# EAGLE design PIRI-MS-S2M (EAGLE 6.4)
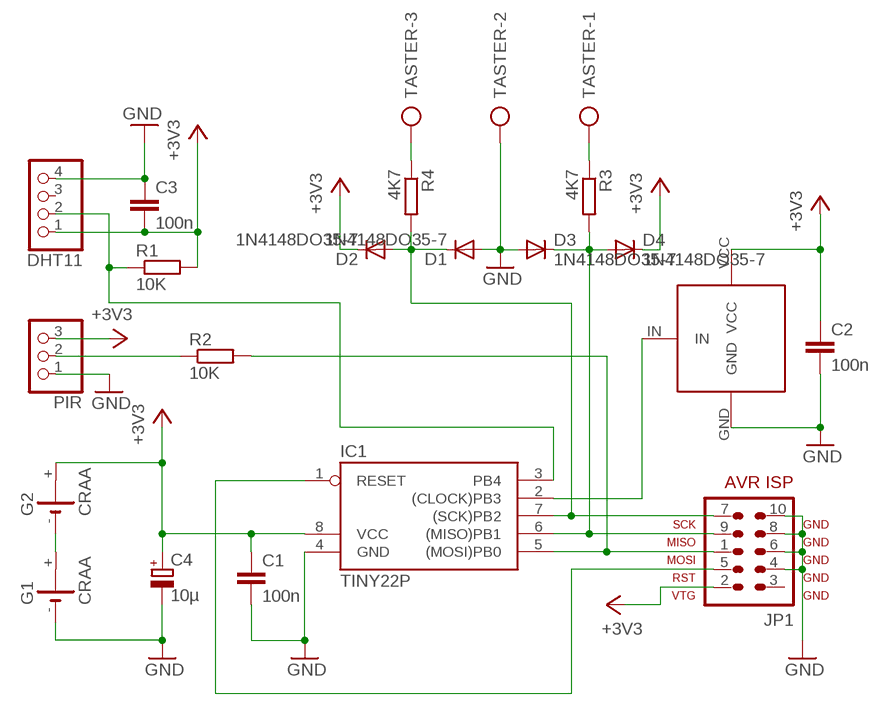
[diagram p0: schematic, sheet 1]

## Parts
C1  100n  C-EU050-024X044  [C050-024X044]
C2  100n  C-EU050-024X044  [C050-024X044]
C3  100n  C-EU050-024X044  [C050-024X044]
C4  10µ  CPOL-EUE5-4  [E5-4]
D1  1N4148DO35-7  [DO35-7]
D2  1N4148DO35-7  [DO35-7]
D3  1N4148DO35-7  [DO35-7]
D4  1N4148DO35-7  [DO35-7]
DHT11  PINHD-1X4  [1X04]
G1  CRAA  [CRAA]
G2  CRAA  [CRAA]
IC1  TINY22P  [DIL08]
JP1  AVR-ISP-10  [AVR-ISP-10]
PIR  PINHD-1X3  [1X03]
R1  10K  R-EU_0204/7  [0204/7]
R2  10K  R-EU_0204/7  [0204/7]
R3  4K7  R-EU_0204/7  [0204/7]
R4  4K7  R-EU_0204/7  [0204/7]
TASTER  AK500/3  [AK500/3]
U$1  TX868  [TX868]

## Nets
+3V3: C1.1 C2.1 C3.2 C4.+ D2.C D4.C DHT11.1 G2.+ IC1.8(VCC) JP1.2 PIR.3 R1.2 U$1.VCC
GND: C1.2 C2.2 C3.1 C4.- D1.A D3.A DHT11.4 G1.- IC1.4(GND) JP1.4 JP1.6 JP1.8 JP1.10 PIR.1 TASTER.2 U$1.GND
N$1: IC1.1(RESET) JP1.5
N$2: IC1.5((MOSI)PB0) JP1.1 R2.2
N$3: D3.C D4.A IC1.6((MISO)PB1) JP1.9 R3.2
N$4: D1.C D2.A IC1.7((SCK)PB2) JP1.7 R4.2
N$5: PIR.2 R2.1
N$6: R4.1 TASTER.3
N$7: IC1.2((CLOCK)PB3) U$1.IN
N$8: DHT11.2 IC1.3(PB4) R1.1
N$9: R3.1 TASTER.1
N$10: G1.+ G2.-
Unconnected: DHT11.3 G1.+@1(+) G2.+@1(+) JP1.3

## Library data of the parts
C1-C3 = resistor:C-EU: CAPACITOR, European symbol
C4 = resistor:CPOL-EU: POLARIZED CAPACITOR, European symbol
D1-D4 = diode:1N4148: DIODE high speed (Philips)
DHT11 = pinhead:PINHD-1X4: PIN HEADER
G1 G2 = battery:CRAA: LI BATTERY Varta
IC1 = avr-7:TINY22: MICROCONTROLLER 1K ROM 128 bytes RAM 128 bytes EEPROM
JP1 = avr-7:AVR-ISP-10: AVR ISP-10 Serial Programming Header
PIR = pinhead:PINHD-1X3: PIN HEADER
R1-R4 = resistor:R-EU_: RESISTOR, European symbol
TASTER = con-ptr500:AK500/3: CONNECTOR; OC_FARNELL: unknown; OC_NEWARK: unknown
U$1 = cassy:TX868: Sendemodul TX868 ELV

## Board
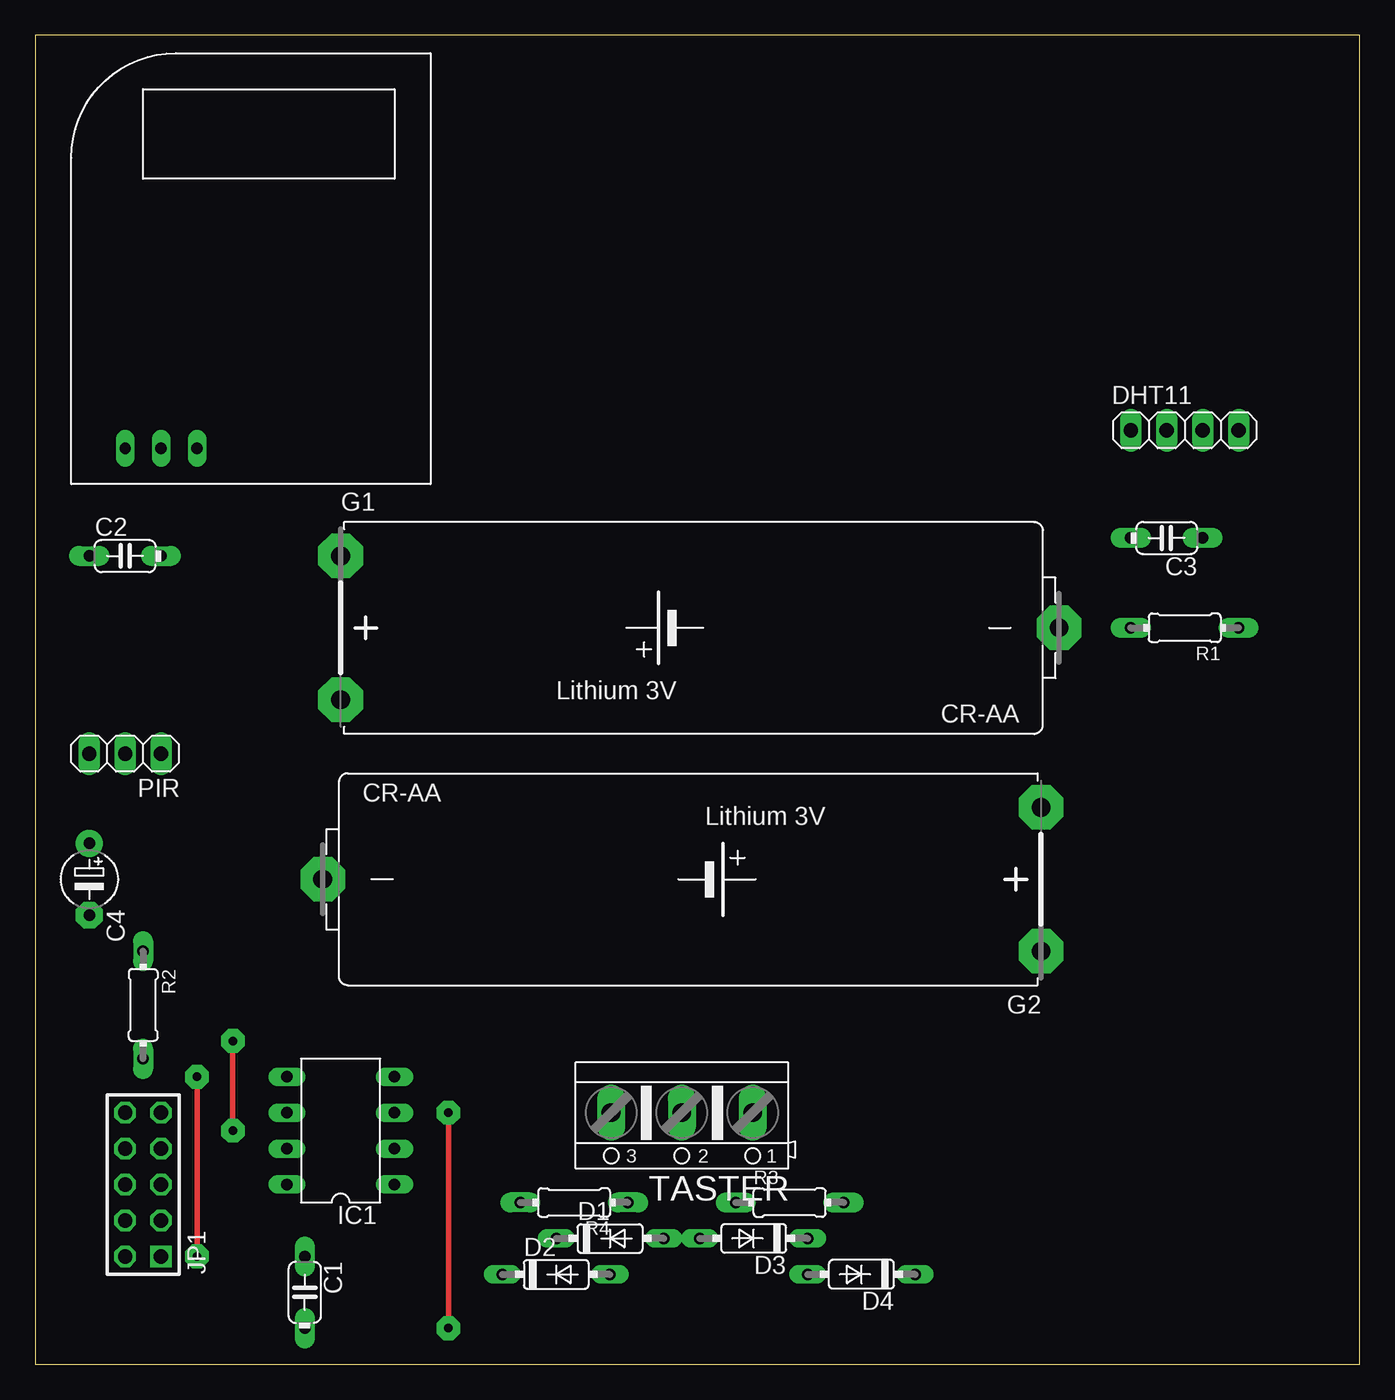
[diagram p1: board, top side]
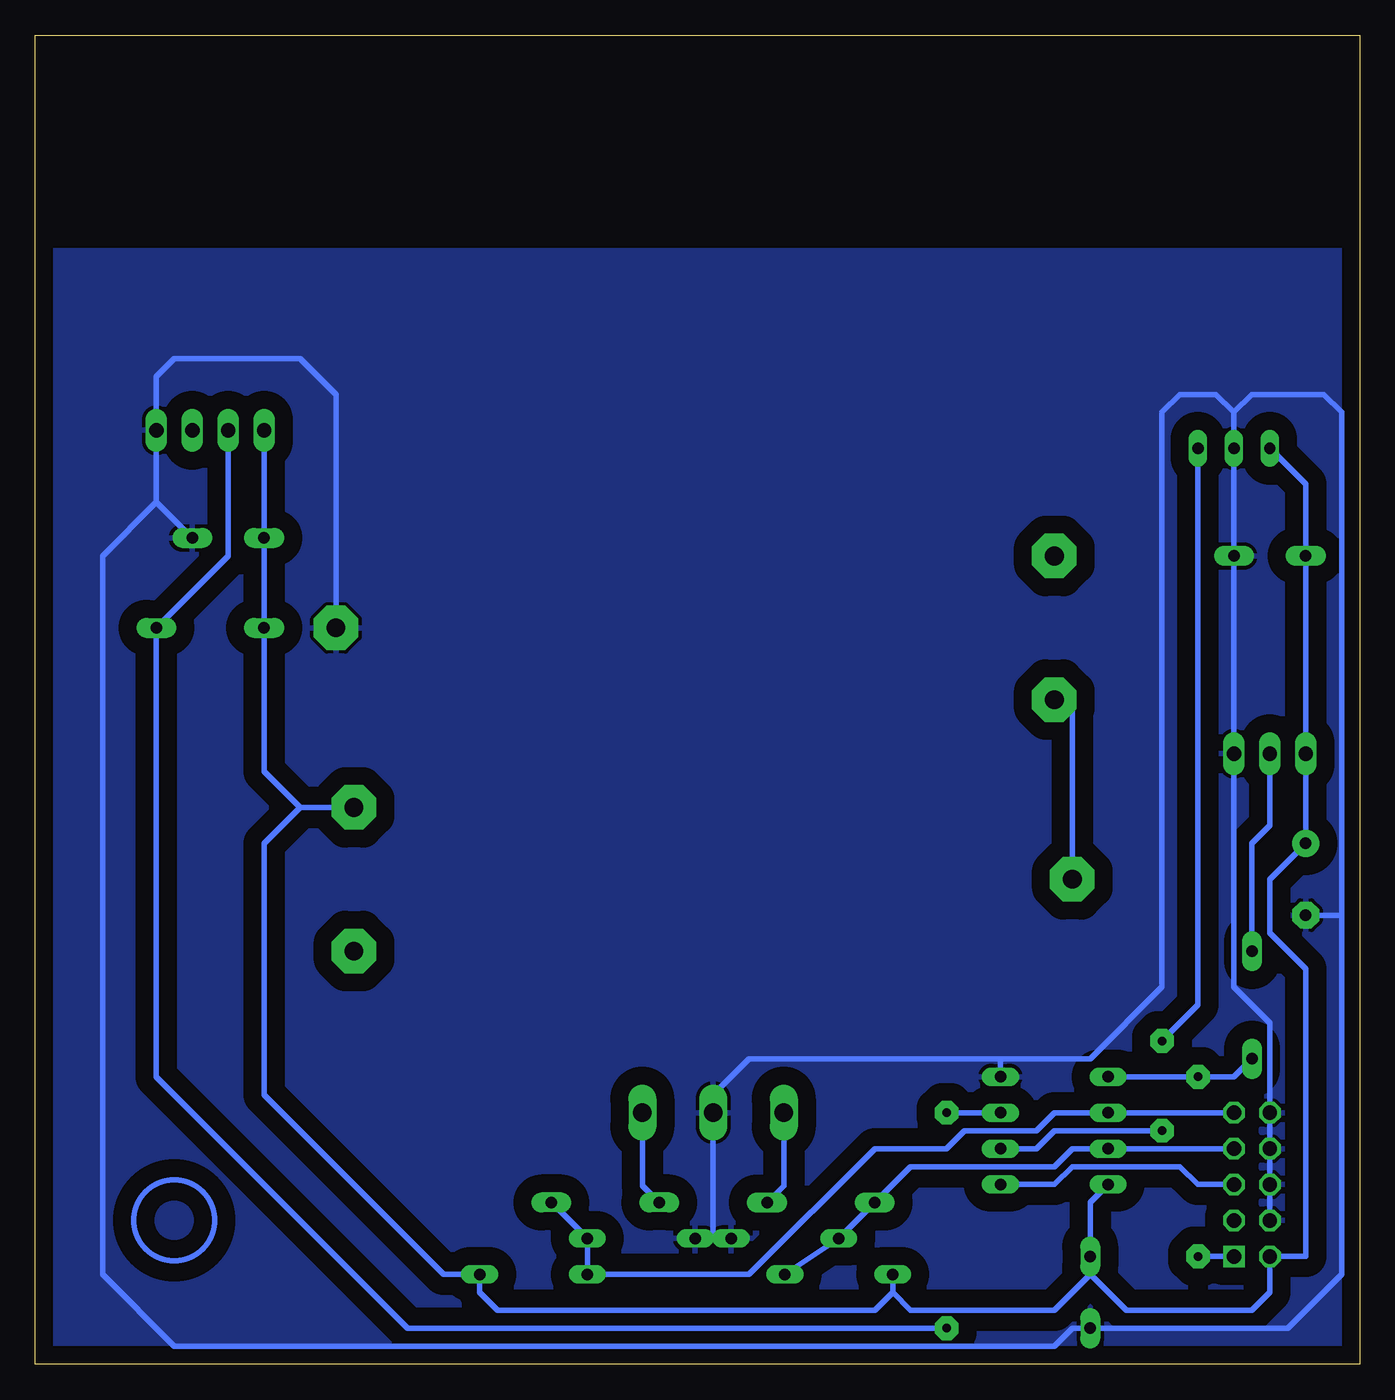
[diagram p2: board, bottom side, seen from below]

Size 93.65 x 93.97 mm. Coordinates in mm from the lower left corner, seen from the top.
Outline: 0,0 93.65,0 93.65,93.97 0,93.97 0,0
Copper layers (1*16): Top 0.035mm / dielectric 1.5mm / Bottom 0.035mm
Design rules "default": minimum track width 10mil, minimum drill 24mil, track to track 8mil, track to pad 8mil, pad to pad 8mil, via to via 8mil, smd to smd 8mil, copper to edge 40mil, drill to drill 8mil, minimum pad ring 10mil, minimum via ring 8mil, stop-mask expansion 4mil, vias tented up to drill 0mil, thermal gap 10mil

### Footprints (pad centres in the part's own frame; a part is rotated, then mirrored left to right if it is on the bottom)
C050-024X044 = drill 0.813 pad 1.422 long: 1 -2.54,0; 2 2.54,0
E5-4 = drill 0.813 pad 1.905: + -2.54,0 | drill 0.813 pad 1.905 octagon: - 2.54,0
DO35-7 = drill 0.813 long: A 3.81,0; C -3.81,0
1X04 = drill 1.016 long: 1 -3.81,0; 2 -1.27,0; 3 1.27,0; 4 3.81,0
CRAA = drill 1.321 pad 3.15 octagon: + -25.4,-5.08; +@1 -25.4,5.08; - 25.4,0
DIL08 = drill 0.813 long: 1 -3.81,-3.81; 2 -1.27,-3.81; 3 1.27,-3.81; 4 3.81,-3.81; 5 3.81,3.81; 6 1.27,3.81; 7 -1.27,3.81; 8 -3.81,3.81
AVR-ISP-10 = drill 1.016 square: 1 -5.08,-1.27 | drill 1.016 octagon: 2 -5.08,1.27; 3 -2.54,-1.27; 4 -2.54,1.27; 5 0,-1.27; 6 0,1.27; 7 2.54,-1.27; 8 2.54,1.27; 9 5.08,-1.27; 10 5.08,1.27
1X03 = drill 1.016 long: 1 -2.54,0; 2 0,0; 3 2.54,0
0204/7 = drill 0.813 pad 1.422 long: 1 -3.81,0; 2 3.81,0
AK500/3 = drill 1.321 long: 1 -5.004,0; 2 0,0; 3 5.004,0
TX868 = drill 0.8 long: GND -6.35,-12.7; IN -3.81,-12.7; VCC -8.89,-12.7

### Placement (x,y rotation side)
C1  19.05,5.08 270 top
C2  6.35,57.15 0 top
C3  80.01,58.42 180 top
C4  3.81,34.29 270 top
D1  40.64,8.89 0 top
D2  36.83,6.35 0 top
D3  50.8,8.89 180 top
D4  58.42,6.35 180 top
DHT11  81.28,66.04 0 top
G1  46.99,52.07 0 top
G2  45.72,34.29 180 top
IC1  21.59,16.51 90 top
JP1  7.62,12.7 90 top
PIR  6.35,43.18 180 top
R1  81.28,52.07 180 top
R2  7.62,25.4 270 top
R3  53.34,11.43 0 top
R4  38.1,11.43 180 top
TASTER  45.72,17.78 180 top
U$1  15.24,77.47 0 top

### Tracks (layer width: path | path; a pad name or v marks a point on that pad's centre or on a via)
+3V3
  Bottom 0.406: U$1.VCC 3.81,62.23 C2.1 PIR.3 C4.+ 6.35,34.29 6.35,30.48 3.81,27.94 3.81,7.62 JP1.2 6.35,5.08 7.62,3.81 16.51,3.81 19.05,6.35 | DHT11.1 C3.2 R1.2 77.47,41.91 74.93,39.37 | 33.02,5.08 34.29,3.81 60.96,3.81 62.23,5.08 D4.C 64.77,6.35 77.47,19.05 77.47,36.83 74.93,39.37 | D2.C 33.02,5.08 | 33.02,5.08 31.75,3.81 21.59,3.81 19.05,6.35 | 19.05,6.35 C1.1 19.05,11.43 IC1.8 | G2.+ 74.93,39.37
GND
  Bottom 0.406: JP1.4 JP1.6 JP1.8 JP1.10 6.35,24.13 8.89,26.67 PIR.1 C2.2 U$1.GND 8.89,67.31 | 85.09,60.96 DHT11.4 85.09,69.85 83.82,71.12 74.93,71.12 72.39,68.58 G1.- | 85.09,60.96 C3.1 | D1.A 45.72,8.89 | 45.72,8.89 D3.A | 45.72,8.89 TASTER.2 45.72,19.05 43.18,21.59 25.4,21.59 | 25.4,21.59 19.05,21.59 13.97,26.67 13.97,67.31 12.7,68.58 10.16,68.58 8.89,67.31 | 1.27,31.75 1.27,6.35 5.08,2.54 C1.2 20.32,2.54 21.59,1.27 83.82,1.27 88.9,6.35 88.9,57.15 85.09,60.96 | 1.27,31.75 1.27,67.31 2.54,68.58 7.62,68.58 8.89,67.31 | C4.- 1.27,31.75 | IC1.4 25.4,21.59
  pour Bottom (isolate 1.27): 0,78.74 93.98,78.74 93.98,1.27 92.71,0 0,0
N$1
  Bottom 0.406: JP1.5 11.43,12.7 12.7,13.97 20.32,13.97 21.59,12.7 IC1.1
N$2  (via drill 0.6 pad 1.68)
  Top 0.406: v11.43,7.62 v11.43,20.32
  Bottom 0.406: IC1.5 v11.43,20.32 8.89,20.32 R2.2 | JP1.1 v11.43,7.62
N$3
  Bottom 0.406: R3.2 D3.C D4.A 43.18,6.35 34.29,15.24 29.21,15.24 27.94,16.51 22.86,16.51 21.59,17.78 IC1.6 JP1.9
N$4
  Bottom 0.406: D2.A D1.C R4.2 31.75,13.97 21.59,13.97 20.32,15.24 IC1.7 JP1.7
N$5
  Bottom 0.406: PIR.2 6.35,38.1 7.62,36.83 R2.1
N$6
  Bottom 0.406: TASTER.3 40.72,12.62 R4.1
N$7  (via drill 0.6 pad 1.68)
  Top 0.406: v13.97,16.51 v13.97,22.86
  Bottom 0.406: IC1.2 22.86,15.24 21.59,16.51 v13.97,16.51 | U$1.IN 11.43,25.4 v13.97,22.86
N$8  (via drill 0.6 pad 1.68)
  Top 0.406: v29.21,17.78 v29.21,2.54
  Bottom 0.406: DHT11.2 80.01,57.15 R1.1 85.09,20.32 67.31,2.54 v29.21,2.54 | IC1.3 v29.21,17.78
N$9
  Bottom 0.406: TASTER.1 50.72,12.62 R3.1
N$10
  Bottom 0.406: G1.+ 20.32,46.99 G2.-
(copper drawn outside any net)
  shapes: Bottom circle x1